# Altium project armBoardProto.PrjPCB
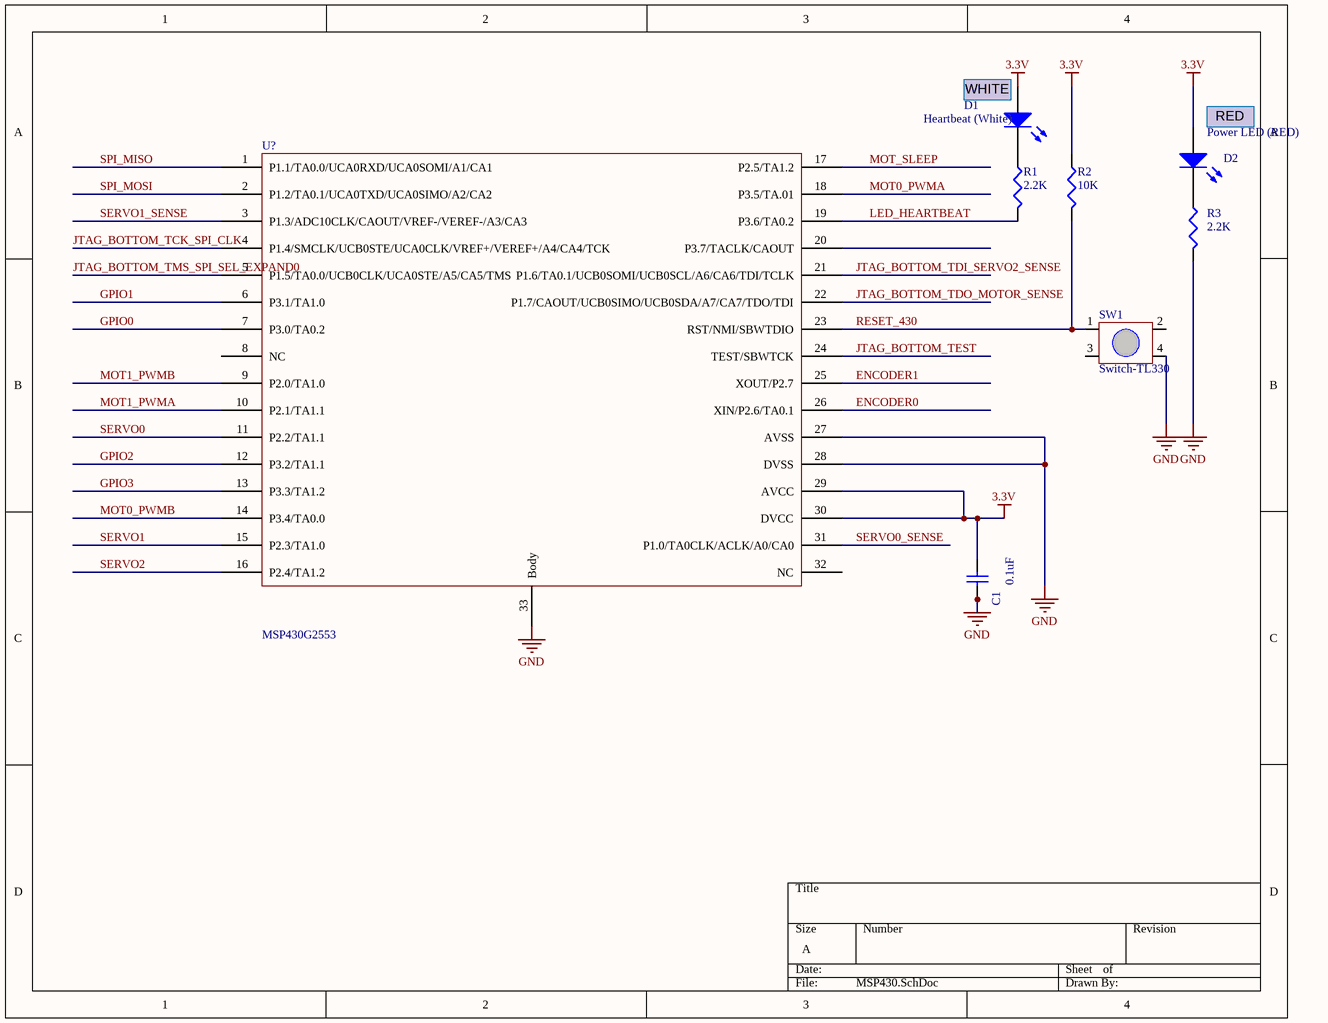
[diagram p0: MSP430.SchDoc]
3 sheets, 50 parts. Net scope: global (net labels, ports and power ports of the same name join across sheets).
Board files: armBoardBeta.PcbDoc, armControlBoardv2.PcbDoc
Sheets:
  MSP430.SchDoc
  Peripherals.SchDoc
  currentSense.SchDoc

## Sheet MSP430.SchDoc
size A

### Parts
C1  value 0.1uF  [CAPC1005L]  (hidden comment: Cap Semi)
D1  Heartbeat (White)  [SurfaceMount(603)]
D2  Power LED (RED)  [SurfaceMount(603)]
R1  value 2.2K  [J1-0603]  (hidden comment: DiodeRes)
R2  value 10K  [J1-0603]  (hidden comment: ResetRes)
R3  value 2.2K  [J1-0603]  (hidden comment: DiodeRes)
SW1  Switch-TL330  [SwitchTall-TL330]
U?  MSP430G2553  [QFN-32]

### Nets
3.3V: C1.2 D1.1(A) D2.1(A) R2.1 U?.29(AVCC) U?.30(DVCC)
GND: C1.1 R3.2 SW1.4 U?.27(AVSS) U?.28(DVSS) U?.33(Body)
ENCODER0: U?.26(XIN/P2.6/TA0.1)
ENCODER1: U?.25(XOUT/P2.7)
GPIO0: U?.7(P3.0/TA0.2)
GPIO1: U?.6(P3.1/TA1.0)
GPIO2: U?.12(P3.2/TA1.1)
GPIO3: U?.13(P3.3/TA1.2)
JTAG_BOTTOM_TCK_SPI_CLK: U?.4(P1.4/SMCLK/UCB0STE/UCA0CLK/VREF+/VEREF+/A4/CA4/TCK)
JTAG_BOTTOM_TDI_SERVO2_SENSE: U?.21(P1.6/TA0.1/UCB0SOMI/UCB0SCL/A6/CA6/TDI/TCLK)
JTAG_BOTTOM_TDO_MOTOR_SENSE: U?.22(P1.7/CAOUT/UCB0SIMO/UCB0SDA/A7/CA7/TDO/TDI)
JTAG_BOTTOM_TEST: U?.24(TEST/SBWTCK)
JTAG_BOTTOM_TMS_SPI_SEL_EXPAND0: U?.5(P1.5/TA0.0/UCB0CLK/UCA0STE/A5/CA5/TMS)
LED_HEARTBEAT: R1.2 U?.19(P3.6/TA0.2)
MOT0_PWMA: U?.18(P3.5/TA.01)
MOT0_PWMB: U?.14(P3.4/TA0.0)
MOT1_PWMA: U?.10(P2.1/TA1.1)
MOT1_PWMB: U?.9(P2.0/TA1.0)
MOT_SLEEP: U?.17(P2.5/TA1.2)
RESET_430: R2.2 SW1.1 U?.23(RST/NMI/SBWTDIO)
SERVO0: U?.11(P2.2/TA1.1)
SERVO0_SENSE: U?.31(P1.0/TA0CLK/ACLK/A0/CA0)
SERVO1: U?.15(P2.3/TA1.0)
SERVO1_SENSE: U?.3(P1.3/ADC10CLK/CAOUT/VREF-/VEREF-/A3/CA3)
SERVO2: U?.16(P2.4/TA1.2)
SPI_MISO: U?.1(P1.1/TA0.0/UCA0RXD/UCA0SOMI/A1/CA1)
SPI_MOSI: U?.2(P1.2/TA0.1/UCA0TXD/UCA0SIMO/A2/CA2)
NetD1_2: D1.2(K) R1.1
NetD2_2: D2.2(K) R3.1

Not connected (* = marked no-connect by the designer): SW1 2 3; U? 8(NC) 20(P3.7/TACLK/CAOUT) 32(NC)

### Notes on the sheet
- (near D1) WHITE
- (near D2) RED

### Library data of the parts
C1 = Cap Semi: Capacitor (Semiconductor SIM Model); Published: 8-Jun-2000; LatestRevisionDate: 29-May-2009; LatestRevisionNote: IPC-7351 Footprint Added.; PackageReference: C1206; Publisher: Altium Limited; PackageDescription: Chip Capacitor
D1 D2 = LED
R1-R3 = Res3: Resistor; Published: 8-Jun-2000; LatestRevisionDate: 29-May-2009; LatestRevisionNote: IPC-7351 Footprint Added.; PackageReference: J1-0603; Publisher: Altium Limited; PackageDescription: Chip Resistor

## Sheet Peripherals.SchDoc
size A
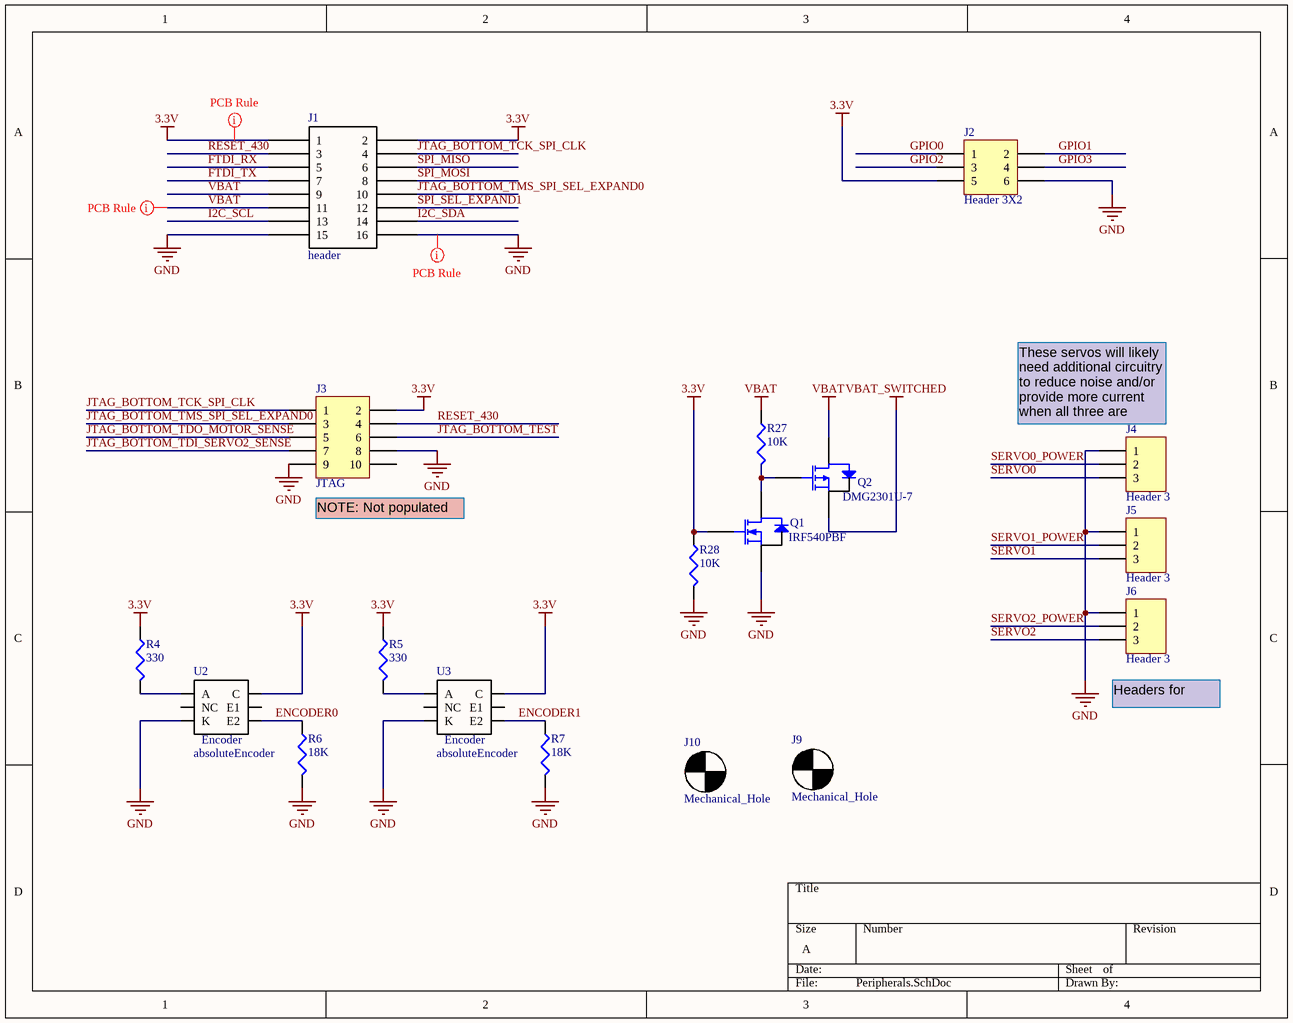
[diagram p1: Peripherals.SchDoc]

### Parts
J1  header  [HEADERSM 8X2]
J2  Header 3X2  [HDR2X3]
J3  JTAG  [HDR2X5]
J4  Header 3  [HDR1X3]
J5  Header 3  [HDR1X3]
J6  Header 3  [HDR1X3]
J9  Mechanical_Hole  [#4_Screw_Hole]
J10  Mechanical_Hole  [#4_Screw_Hole]
Q1  IRF540PBF  [SOT-23]
Q2  DMG2301U-7  [SOT-23]
R4  value 330  [J1-0603]  (hidden comment: A)
R5  value 330  [J1-0603]  (hidden comment: A)
R6  value 18K  [J1-0603]  (hidden comment: E2)
R7  value 18K  [J1-0603]  (hidden comment: E2)
R27  value 10K  [J1-0603]
R28  value 10K  [J1-0603]
U2  absoluteEncoder  [absoluteEncoder]
U3  absoluteEncoder  [absoluteEncoder]

### Nets
3.3V: J1.1 J1.2 J2.5 J3.2 Q1.1(G) R4.1 R5.1 R28.1 U2.C U3.C
GND: J1.15 J1.16 J2.6 J3.8 J3.9 J4.1 J5.1 J6.1 Q1.2(S) R6.2 R7.2 R28.2 U2.K U3.K
VBAT: J1.9 J1.11 Q2.3(D) R27.1
VBAT_SWITCHED: Q2.2(S)
ENCODER0: R6.1 U2.E2
ENCODER1: R7.1 U3.E2
FTDI_RX: J1.5
FTDI_TX: J1.7
GPIO0: J2.1
GPIO1: J2.2
GPIO2: J2.3
GPIO3: J2.4
I2C_SCL: J1.13
I2C_SDA: J1.14
JTAG_BOTTOM_TCK_SPI_CLK: J1.4 J3.1
JTAG_BOTTOM_TDI_SERVO2_SENSE: J3.7
JTAG_BOTTOM_TDO_MOTOR_SENSE: J3.5
JTAG_BOTTOM_TEST: J3.6
JTAG_BOTTOM_TMS_SPI_SEL_EXPAND0: J1.10 J3.3
RESET_430: J1.3 J3.4
SERVO0: J4.3
SERVO0_POWER: J4.2
SERVO1: J5.3
SERVO1_POWER: J5.2
SERVO2: J6.3
SERVO2_POWER: J6.2
SPI_MISO: J1.6
SPI_MOSI: J1.8
SPI_SEL_EXPAND1: J1.12
NetQ1_3: Q1.3(D) Q2.1(G) R27.2
NetR4_2: R4.2 U2.A
NetR5_2: R5.2 U3.A

Not connected (* = marked no-connect by the designer): J3 10; U2 E1 NC; U3 E1 NC

### Layout directives
rule Width Constraint [Pref Width = 20mil    Min Width = 10mil    Max Width = 25mil]: 3.3V, GND, VBAT

### Notes on the sheet
- (near J4) These servos will likely need additional circuitry to reduce noise and/or provide more current when all three are going.
- (near J3) NOTE: Not populated
- (near J6) Headers for servos
- (in symbol absoluteEncoder) Encoder

### Library data of the parts
J1 = HEADER 8X2
J2 = Header 3X2: Header, 3-Pin, Dual row; LatestRevisionDate: 17-Jul-2002; LatestRevisionNote: Re-released for DXP Platform.; Publisher: Altium Limited
J3 = Header 5X2: Header, 5-Pin, Dual row; LatestRevisionDate: 17-Jul-2002; LatestRevisionNote: Re-released for DXP Platform.; Publisher: Altium Limited
J4-J6 = Header 3: Header, 3-Pin; LatestRevisionDate: 17-Jul-2002; LatestRevisionNote: Re-released for DXP Platform.; Publisher: Altium Limited
J9 J10 = Mechanical_Hole: A mechanical hole for mounting the board
Q1 = N-Mosfet
Q2 = P-Mosfet
R4-R7 R27 R28 = Res3: Resistor; Published: 8-Jun-2000; LatestRevisionDate: 29-May-2009; LatestRevisionNote: IPC-7351 Footprint Added.; PackageReference: J1-0603; Publisher: Altium Limited; PackageDescription: Chip Resistor

## Sheet currentSense.SchDoc
size A
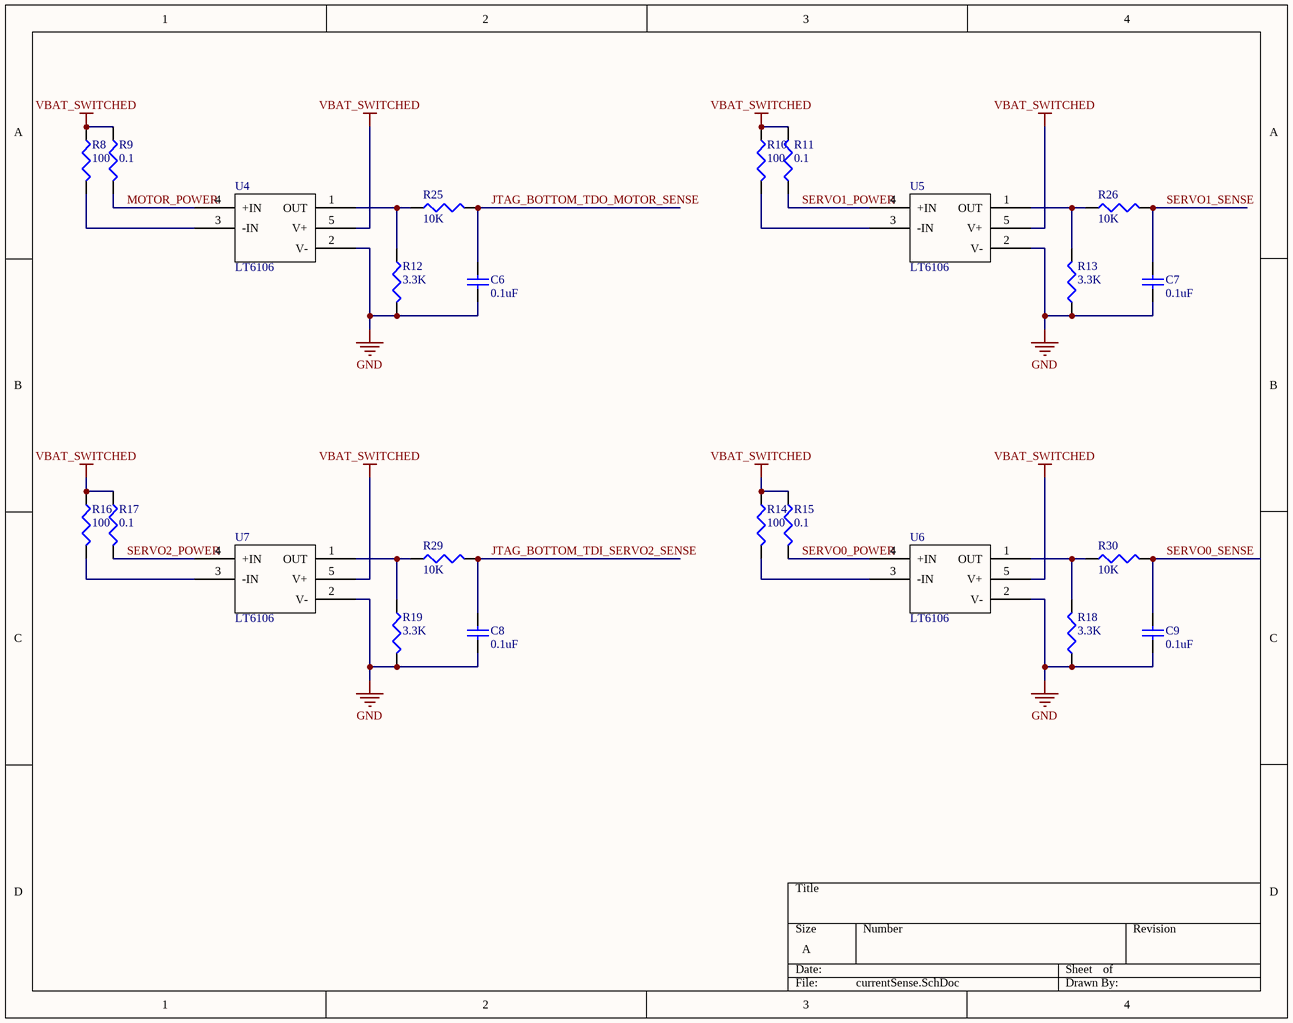
[diagram p2: currentSense.SchDoc]

### Parts
C6  value 0.1uF  [CAPC1005L]  (hidden comment: Cap Semi)
C7  value 0.1uF  [CAPC1005L]  (hidden comment: Cap Semi)
C8  value 0.1uF  [CAPC1005L]  (hidden comment: Cap Semi)
C9  value 0.1uF  [CAPC1005L]  (hidden comment: Cap Semi)
R8  value 100  [J1-0603]  (hidden comment: R_IN)
R9  value 0.1  [J1-0603]  (hidden comment: RLOAD)
R10  value 100  [J1-0603]  (hidden comment: R_IN)
R11  value 0.1  [J1-0603]  (hidden comment: RLOAD)
R12  value 3.3K  [J1-0603]  (hidden comment: R_OUT)
R13  value 3.3K  [J1-0603]  (hidden comment: R_OUT)
R14  value 100  [J1-0603]  (hidden comment: R_IN)
R15  value 0.1  [J1-0603]  (hidden comment: RLOAD)
R16  value 100  [J1-0603]  (hidden comment: R_IN)
R17  value 0.1  [J1-0603]  (hidden comment: RLOAD)
R18  value 3.3K  [J1-0603]  (hidden comment: R_OUT)
R19  value 3.3K  [J1-0603]  (hidden comment: R_OUT)
R25  value 10K  [J1-0603]  (hidden comment: LPF)
R26  value 10K  [J1-0603]  (hidden comment: LPF)
R29  value 10K  [J1-0603]  (hidden comment: LPF)
R30  value 10K  [J1-0603]  (hidden comment: LPF)
U4  LT6106  [TSOT-23-5_LT6106]
U5  LT6106  [TSOT-23-5_LT6106]
U6  LT6106  [TSOT-23-5_LT6106]
U7  LT6106  [TSOT-23-5_LT6106]

### Nets
GND: C6.1 C7.1 C8.1 C9.1 R12.2 R13.1 R18.1 R19.2 U4.2(V-) U5.2(V-) U6.2(V-) U7.2(V-)
VBAT_SWITCHED: R8.1 R9.1 R10.1 R11.2 R14.1 R15.1 R16.1 R17.1 U4.5(V+) U5.5(V+) U6.5(V+) U7.5(V+)
JTAG_BOTTOM_TDI_SERVO2_SENSE: C8.2 R29.2
JTAG_BOTTOM_TDO_MOTOR_SENSE: C6.2 R25.2
MOTOR_POWER: R9.2 U4.4(+IN)
SERVO0_POWER: R15.2 U6.4(+IN)
SERVO0_SENSE: C9.2 R30.2
SERVO1_POWER: R11.1 U5.4(+IN)
SERVO1_SENSE: C7.2 R26.2
SERVO2_POWER: R17.2 U7.4(+IN)
NetR8_2: R8.2 U4.3(-IN)
NetR10_2: R10.2 U5.3(-IN)
NetR12_1: R12.1 R25.1 U4.1(OUT)
NetR13_2: R13.2 R26.1 U5.1(OUT)
NetR14_2: R14.2 U6.3(-IN)
NetR16_2: R16.2 U7.3(-IN)
NetR18_2: R18.2 R30.1 U6.1(OUT)
NetR19_1: R19.1 R29.1 U7.1(OUT)

### Library data of the parts
C6-C9 = Cap Semi: Capacitor (Semiconductor SIM Model); Published: 8-Jun-2000; LatestRevisionDate: 29-May-2009; LatestRevisionNote: IPC-7351 Footprint Added.; PackageReference: C1206; Publisher: Altium Limited; PackageDescription: Chip Capacitor
R8-R19 R25 R26 R29 R30 = Res3: Resistor; Published: 8-Jun-2000; LatestRevisionDate: 29-May-2009; LatestRevisionNote: IPC-7351 Footprint Added.; PackageReference: J1-0603; Publisher: Altium Limited; PackageDescription: Chip Resistor
U4-U7 = LT6106: Current Sense Amplifier

## Nets that join several sheets
3.3V: MSP430 (6 pins), Peripherals (10 pins)
GND: MSP430 (6 pins), Peripherals (14 pins), currentSense (12 pins)
VBAT_SWITCHED: Peripherals (Q2.2), currentSense (12 pins)
ENCODER0: MSP430 (U?.26), Peripherals (R6.1 U2.E2)
ENCODER1: MSP430 (U?.25), Peripherals (R7.1 U3.E2)
GPIO0: MSP430 (U?.7), Peripherals (J2.1)
GPIO1: MSP430 (U?.6), Peripherals (J2.2)
GPIO2: MSP430 (U?.12), Peripherals (J2.3)
GPIO3: MSP430 (U?.13), Peripherals (J2.4)
JTAG_BOTTOM_TCK_SPI_CLK: MSP430 (U?.4), Peripherals (J1.4 J3.1)
JTAG_BOTTOM_TDI_SERVO2_SENSE: MSP430 (U?.21), Peripherals (J3.7), currentSense (C8.2 R29.2)
JTAG_BOTTOM_TDO_MOTOR_SENSE: MSP430 (U?.22), Peripherals (J3.5), currentSense (C6.2 R25.2)
JTAG_BOTTOM_TEST: MSP430 (U?.24), Peripherals (J3.6)
JTAG_BOTTOM_TMS_SPI_SEL_EXPAND0: MSP430 (U?.5), Peripherals (J1.10 J3.3)
RESET_430: MSP430 (R2.2 SW1.1 U?.23), Peripherals (J1.3 J3.4)
SERVO0: MSP430 (U?.11), Peripherals (J4.3)
SERVO0_POWER: Peripherals (J4.2), currentSense (R15.2 U6.4)
SERVO0_SENSE: MSP430 (U?.31), currentSense (C9.2 R30.2)
SERVO1: MSP430 (U?.15), Peripherals (J5.3)
SERVO1_POWER: Peripherals (J5.2), currentSense (R11.1 U5.4)
SERVO1_SENSE: MSP430 (U?.3), currentSense (C7.2 R26.2)
SERVO2: MSP430 (U?.16), Peripherals (J6.3)
SERVO2_POWER: Peripherals (J6.2), currentSense (R17.2 U7.4)
SPI_MISO: MSP430 (U?.1), Peripherals (J1.6)
SPI_MOSI: MSP430 (U?.2), Peripherals (J1.8)